# Altium schematic sheet PWR.SchDoc
size A3; SheetNumber: 9; SheetTotal: 11
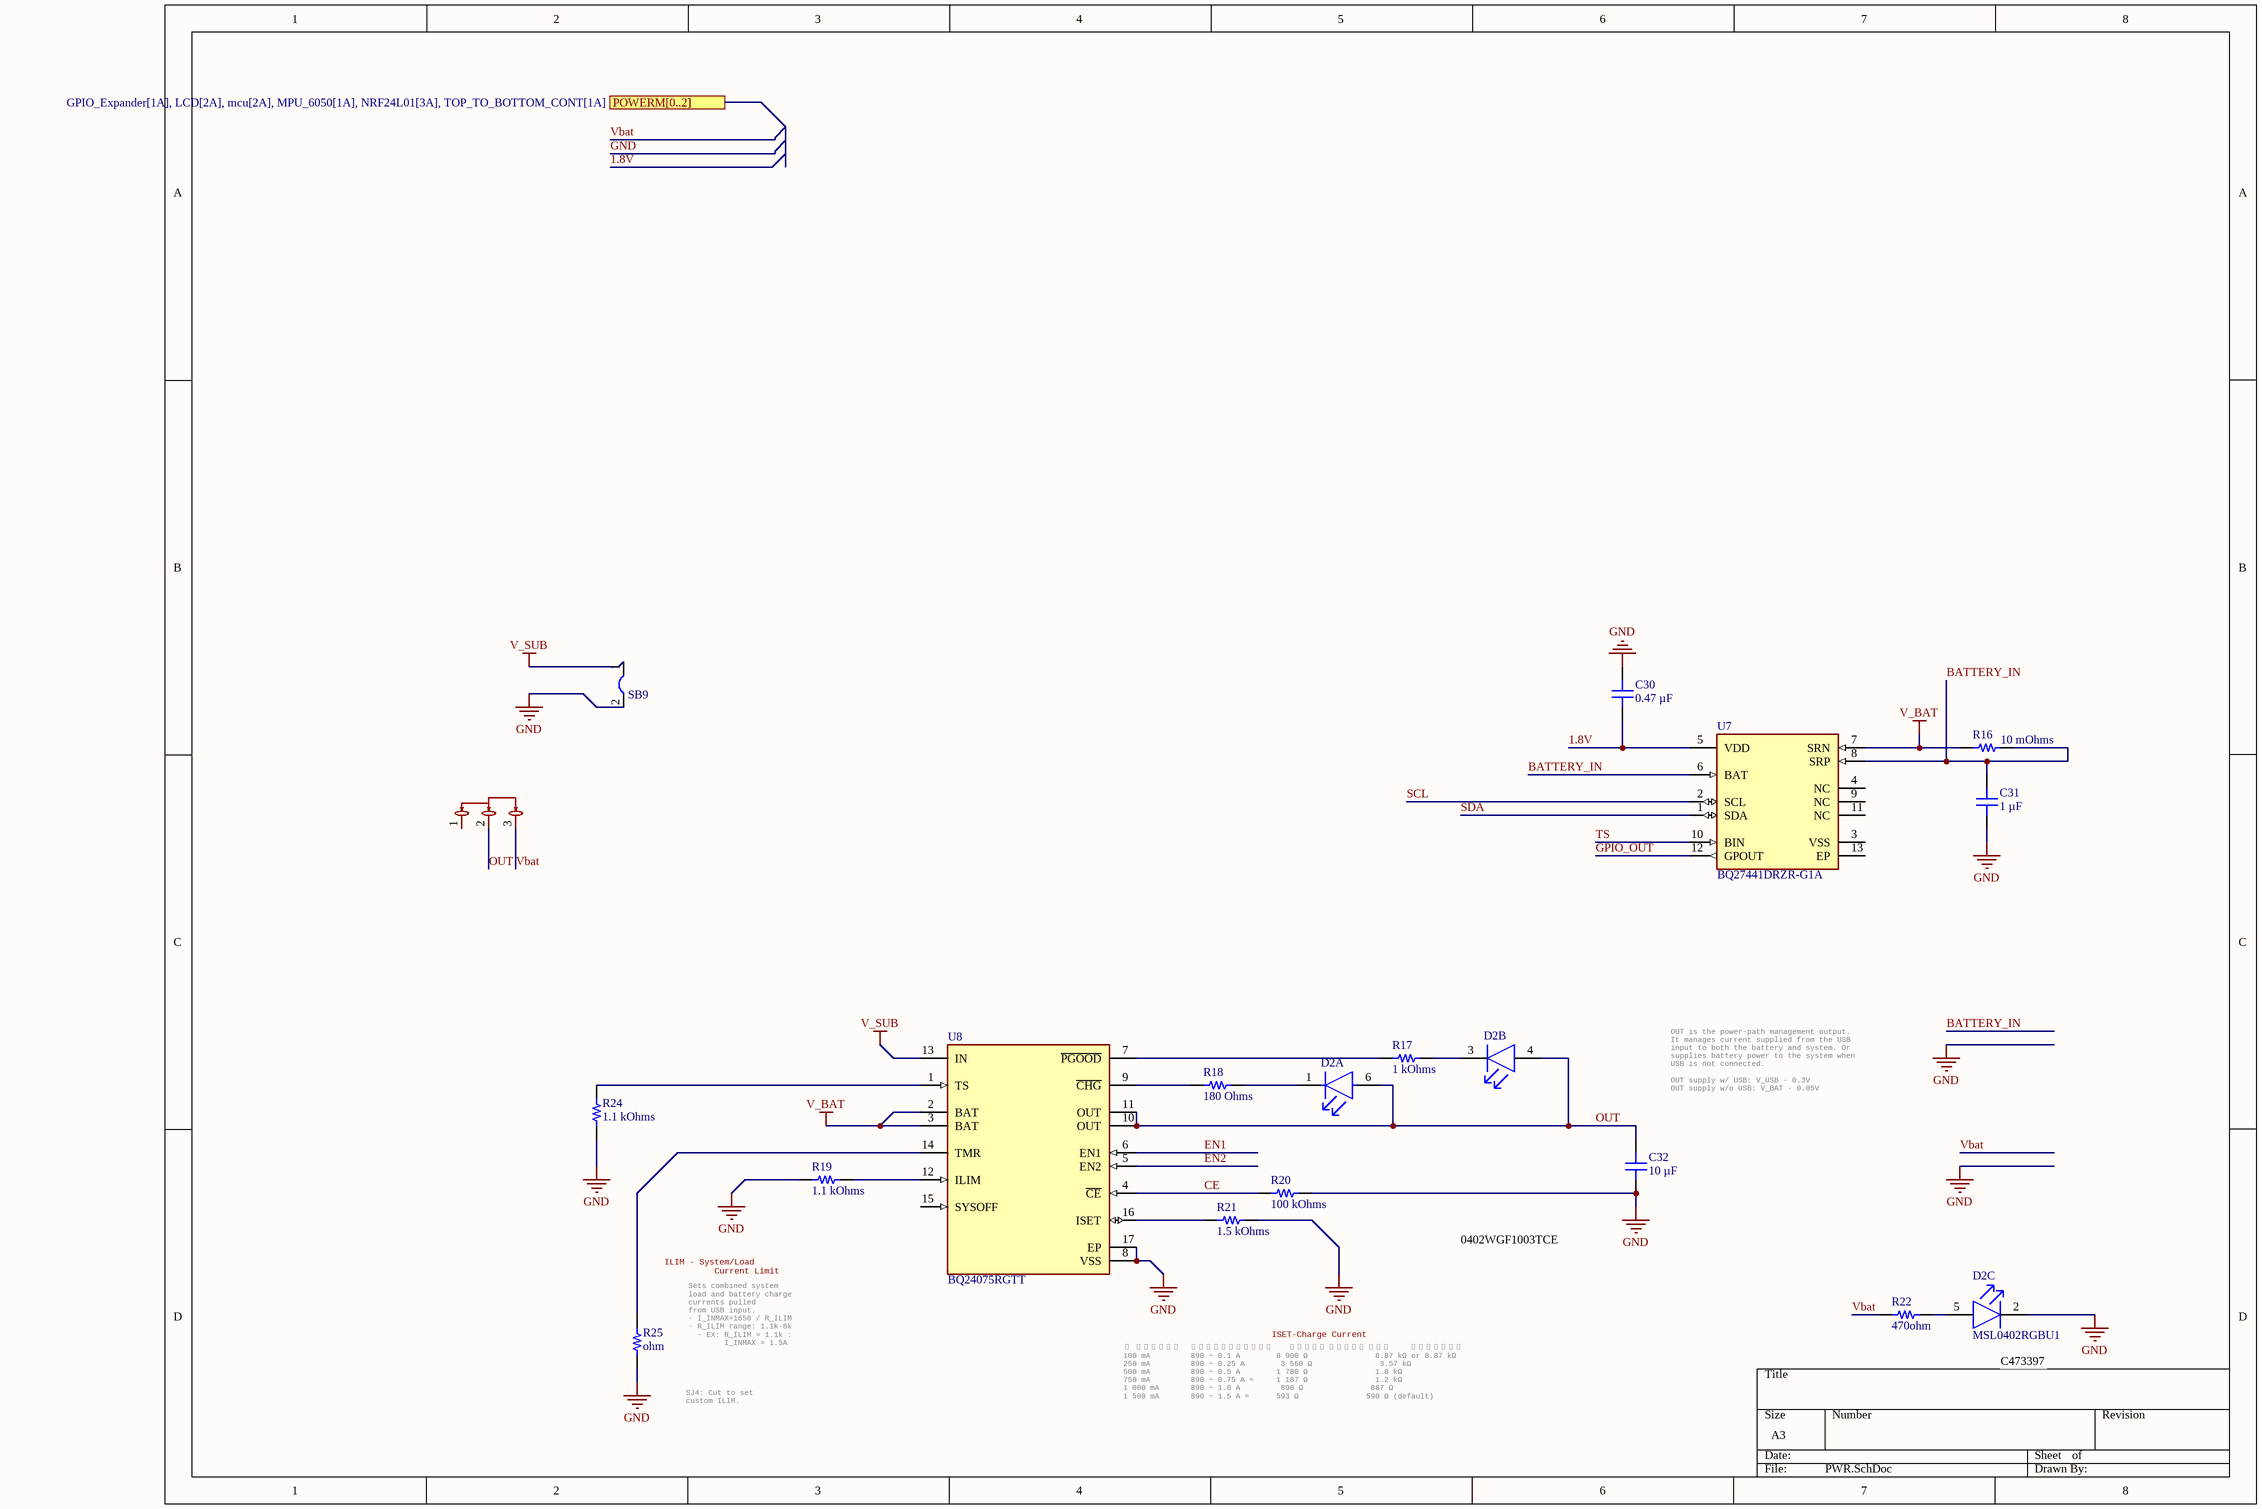
[diagram p0: PWR.SchDoc]

## Parts
C30  Capacitance: 0.47 µF  [CAP 0402_1005]
C31  Capacitance: 1 µF  [MURATA GRM155 0402_1005]
C32  10 µF  [CAP 0402_1005]
D2  MSL0402RGBU1  [FP-MSL0402-MFG]  (value not drawn)  (parts A,B,C of 3)
R16  10 mOhms  [RES 0402_1005]
R17  1 kOhms  [RES 0402_1005]
R18  180 Ohms  [YAGEO RES 0402_1005]
R19  1.1 kOhms  [YAGEO RES 0402_1005]
R20  100 kOhms  [RES 0402_1005]
R21  1.5 kOhms  [RES 0402_1005]
R22  470ohm  [RES 0402_1005]
R24  1.1 kOhms  [YAGEO RES 0402_1005]
R25  ohm  [YAGEO RES 0402_1005]
SB9  Jumper  [Jumper]  (value not drawn)
SW2  MST-12D18G4 SPDT Slide Switch  [SW-SMD_MST-12D18G4-SPDT-SLIDE-SWITCH]  (value not drawn)
U7  BQ27441DRZR-G1A  [FP-DRZ0012A-MFG]
U8  BQ24075RGTT  [FP-RGT0016C-IPC_C]

## Ports
POWERM[0..2] (see GPIO_Expander[1A], LCD[2A], mcu[2A], MPU_6050[1A], NRF24L01[3A], TOP_TO_BOTTOM_CONT[1A])

## Nets
GND: C30.1 C31.1 C32.1 D2.2(GREEN_C) R19.1 R20.1 R21.2 R24.1 R25.1 SB9.2 U8.8(VSS) U8.17(EP)
V_BAT: R16.1 U7.7(SRN) U8.2(BAT) U8.3(BAT)
V_SUB: SB9.1 U8.13(IN)
1.8V: C30.2 U7.5(VDD)
BATTERY_IN: C31.2 R16.2 U7.6(BAT) U7.8(SRP)
CE: R20.2 U8.4(~{CE})
EN1: U8.6(EN1)
EN2: U8.5(EN2)
GPIO_OUT: U7.12(GPOUT)
OUT: C32.2 D2.4(RED_A) D2.6(BLUE_A) SW2.2 U8.10(OUT) U8.11(OUT)
SCL: U7.2(SCL)
SDA: U7.1(SDA)
TS: U7.10(BIN)
Vbat: R22.1 SW2.3
NetD2_1: D2.1(BLUE_C) R18.1
NetD2_3: D2.3(RED_C) R17.2
NetD2_5: D2.5(GREEN_A) R22.2
NetR17_1: R17.1 U8.7(~{PGOOD})
NetR18_2: R18.2 U8.9(~{CHG})
NetR19_2: R19.2 U8.12(ILIM)
NetR21_1: R21.1 U8.16(ISET)
NetR24_2: R24.2 U8.1(TS)
NetR25_2: R25.2 U8.14(TMR)

Not connected (* = marked no-connect by the designer): SW2 1; U7 3(VSS) 4(NC) 9(NC) 11(NC) 13(EP); U8 15(SYSOFF)

## Notes on the sheet
- OUT is the power-path management output.
  It manages current supplied from the USB
  input to both the battery and system. Or
  supplies battery power to the system when
  USB is not connected.
  OUT supply w/ USB: V_USB - 0.3V
  OUT supply w/o USB: V_BAT - 0.05V
- 0402WGF1003TCE
- ILIM - System/Load
  Current Limit
- ISET-Charge Current
- (near R25) Sets combined system
  load and battery charge
  currents pulled
  from USB input.
  - I_INMAX=1650 / R_ILIM
  - R_ILIM range: 1.1k-8k
  - EX: R_ILIM = 1.1k :
  I_INMAX = 1.5A
- (near D2) C473397
- SJ4: Cut to set
  custom ILIM.
- I  CHARGE     Calculation	       𝑅𝐼𝑆𝐸𝑇 RISET (Ω)          R_Value
  100 mA	        890 ÷ 0.1 A	       8 900 Ω	              8.87 kΩ or 8.87 kΩ
  250 mA	        890 ÷ 0.25 A	       3 560 Ω	              3.57 kΩ
  500 mA	        890 ÷ 0.5 A	       1 780 Ω	              1.8 kΩ
  750 mA	        890 ÷ 0.75 A	≈     1 187 Ω	              1.2 kΩ
  1 000 mA       890 ÷ 1.0 A	        890 Ω	              887 Ω
  1 500 mA       890 ÷ 1.5 A	≈      593 Ω	              590 Ω (default)

## Library data of the parts
C30 = C1005X5R1V474K050BE: CAP CER 0.47UF 35V X5R 0402; MFR.Part #: GRM155R61A474KE15D; Manufacturer: Murata Electronics; JLCPCB Part #: C77003
C31 = GRM155C71A105KE11D: CAP CER 1UF 10V X7S 0402; MFR.Part #: GRM155R60J105KE19D; Manufacturer: Murata Electronics; JLCPCB Part #: C15684
C32 = CL05A106MP8NUB8: CAP CER 10UF 10V X5R 0402; MFR.Part #: CL05A106MQ5NUNC; Manufacturer: Samsung Electro-Mechanics; Capacitance: 10 µF; JLCPCB Part #: C15525
D2 = CMP-08952-000010-1: LED RGB DIFFUSED 1816 SMD; ComponentLink2Description: Datasheet; ComponentLink2URL: https://d1d2qsbl8m0m72.cloudfront.net/en/products/databook/datasheet/opto/led/chip_multi/msl0402rgb-e.pdf; Device Class L3: unset; MFR.Part #: MSL0402RGBU1; JLCPCB Part #: C2898980
R16 = PMR01ZZPJU10L: RES 0.01 OHM 5% 1/5W 0402; MFR.Part #: PE0402FRF070R01L; Manufacturer: YAGEO; Value: 10 mOhms; ComponentLink1Description: Datasheet; ComponentLink1URL: https://www.rohm.com/datasheet/PMR18EZPFV/pmr-e; ComponentLink2Description: DigiKey Link; ComponentLink2URL: https://www.digikey.com/en/products/detail/rohm-semiconductor/PMR01ZZPJU10L/5218668; JLCPCB Part #: C2089431
R17 = RQ73C1E1K0BTD: RES 1 KOHMS 0.1% 1/16W 0402; MFR.Part #: 0402WGF1001TCE; Manufacturer: UNI-ROYAL(Uniroyal Elec); Value: 1 kOhms; JLCPCB Part #: C11702
R18 = RT0402BRD07180RL: RES SMD 180 OHM 0.1% 1/16W 0402; MFR.Part #: C38941; Manufacturer: UNI-ROYAL(Uniroyal Elec); Value: 180 Ohms; JLCPCB Part #: 0402WGF1800TCE
R19 R24 = RC0402FR-071K1L: RES 1.1K OHM 1% 1/16W 0402; MFR.Part #: 0402WGF1101TCE; Manufacturer: UNI-ROYAL(Uniroyal Elec); Value: 1.1 kOhms; JLCPCB Part #: C25860
R20 = RP73PF1E100KBTD: RES 100K OHM 0.1% 1/10W 0402; MFR.Part #: 0402WGF1003TCE; Manufacturer: UNI-ROYAL(Uniroyal Elec); Value: 100 kOhms; JLCPCB Part #: 0402
R21 = RR0510P-152-D: RES SMD 1.5K OHM 0.5% 1/16W 0402; MFR.Part #: CRCW04021K50FKED; Manufacturer: Vishay Intertech; Value: 1.5 kOhms; JLCPCB Part #: C71622
R22 = RR0510P-152-D: RES SMD 1.5K OHM 0.5% 1/16W 0402; MFR.Part #: 0402WGF1501TCE; Manufacturer: UNI-ROYAL(Uniroyal Elec); Value: 1.5 kOhms; JLCPCB Part #: C25867
R25 = RC0402FR-071K1L: RES 1.1K OHM 1% 1/16W 0402; MFR.Part #: 0402WGF0000TCE; Manufacturer: UNI-ROYAL(Uniroyal Elec); Value: ohm; JLCPCB Part #: C17168
SW2 = MST-12D18G4 SPDT Slide Switch: MFR.Part #: C49023767; Manufacturer: SHOU HAN; JLCPCB Part #: MST-12D18G4 SPDT Slide Switch
U7 = CMP-04911-000008-1: IC BATT FUEL GAUGE LI-ION 12SON; Manufacturer: Texas Instruments; ComponentLink2URL: http://www.ti.com/lit/gpn/bq27441-g1; ComponentLink2Description: Datasheet; MFR.Part #: BQ27441DRZR-G1A; JLCPCB Part #: C473397
U8 = CMP-0321-00236-3: IC LI-ION CHARGE/PWR MGMT 16-QFN; Manufacturer: Texas Instruments; MFR.Part #: BQ24075RGTT; JLCPCB Part #: C2865459